# Altium schematic sheet Sheet6.SchDoc
size 420 x 297 mm; DocumentNumber: ЭАЕСН.464512.003Э3; SheetNumber: 6; SheetTotal: x; DocumentName: Sheet1.SCHDOC
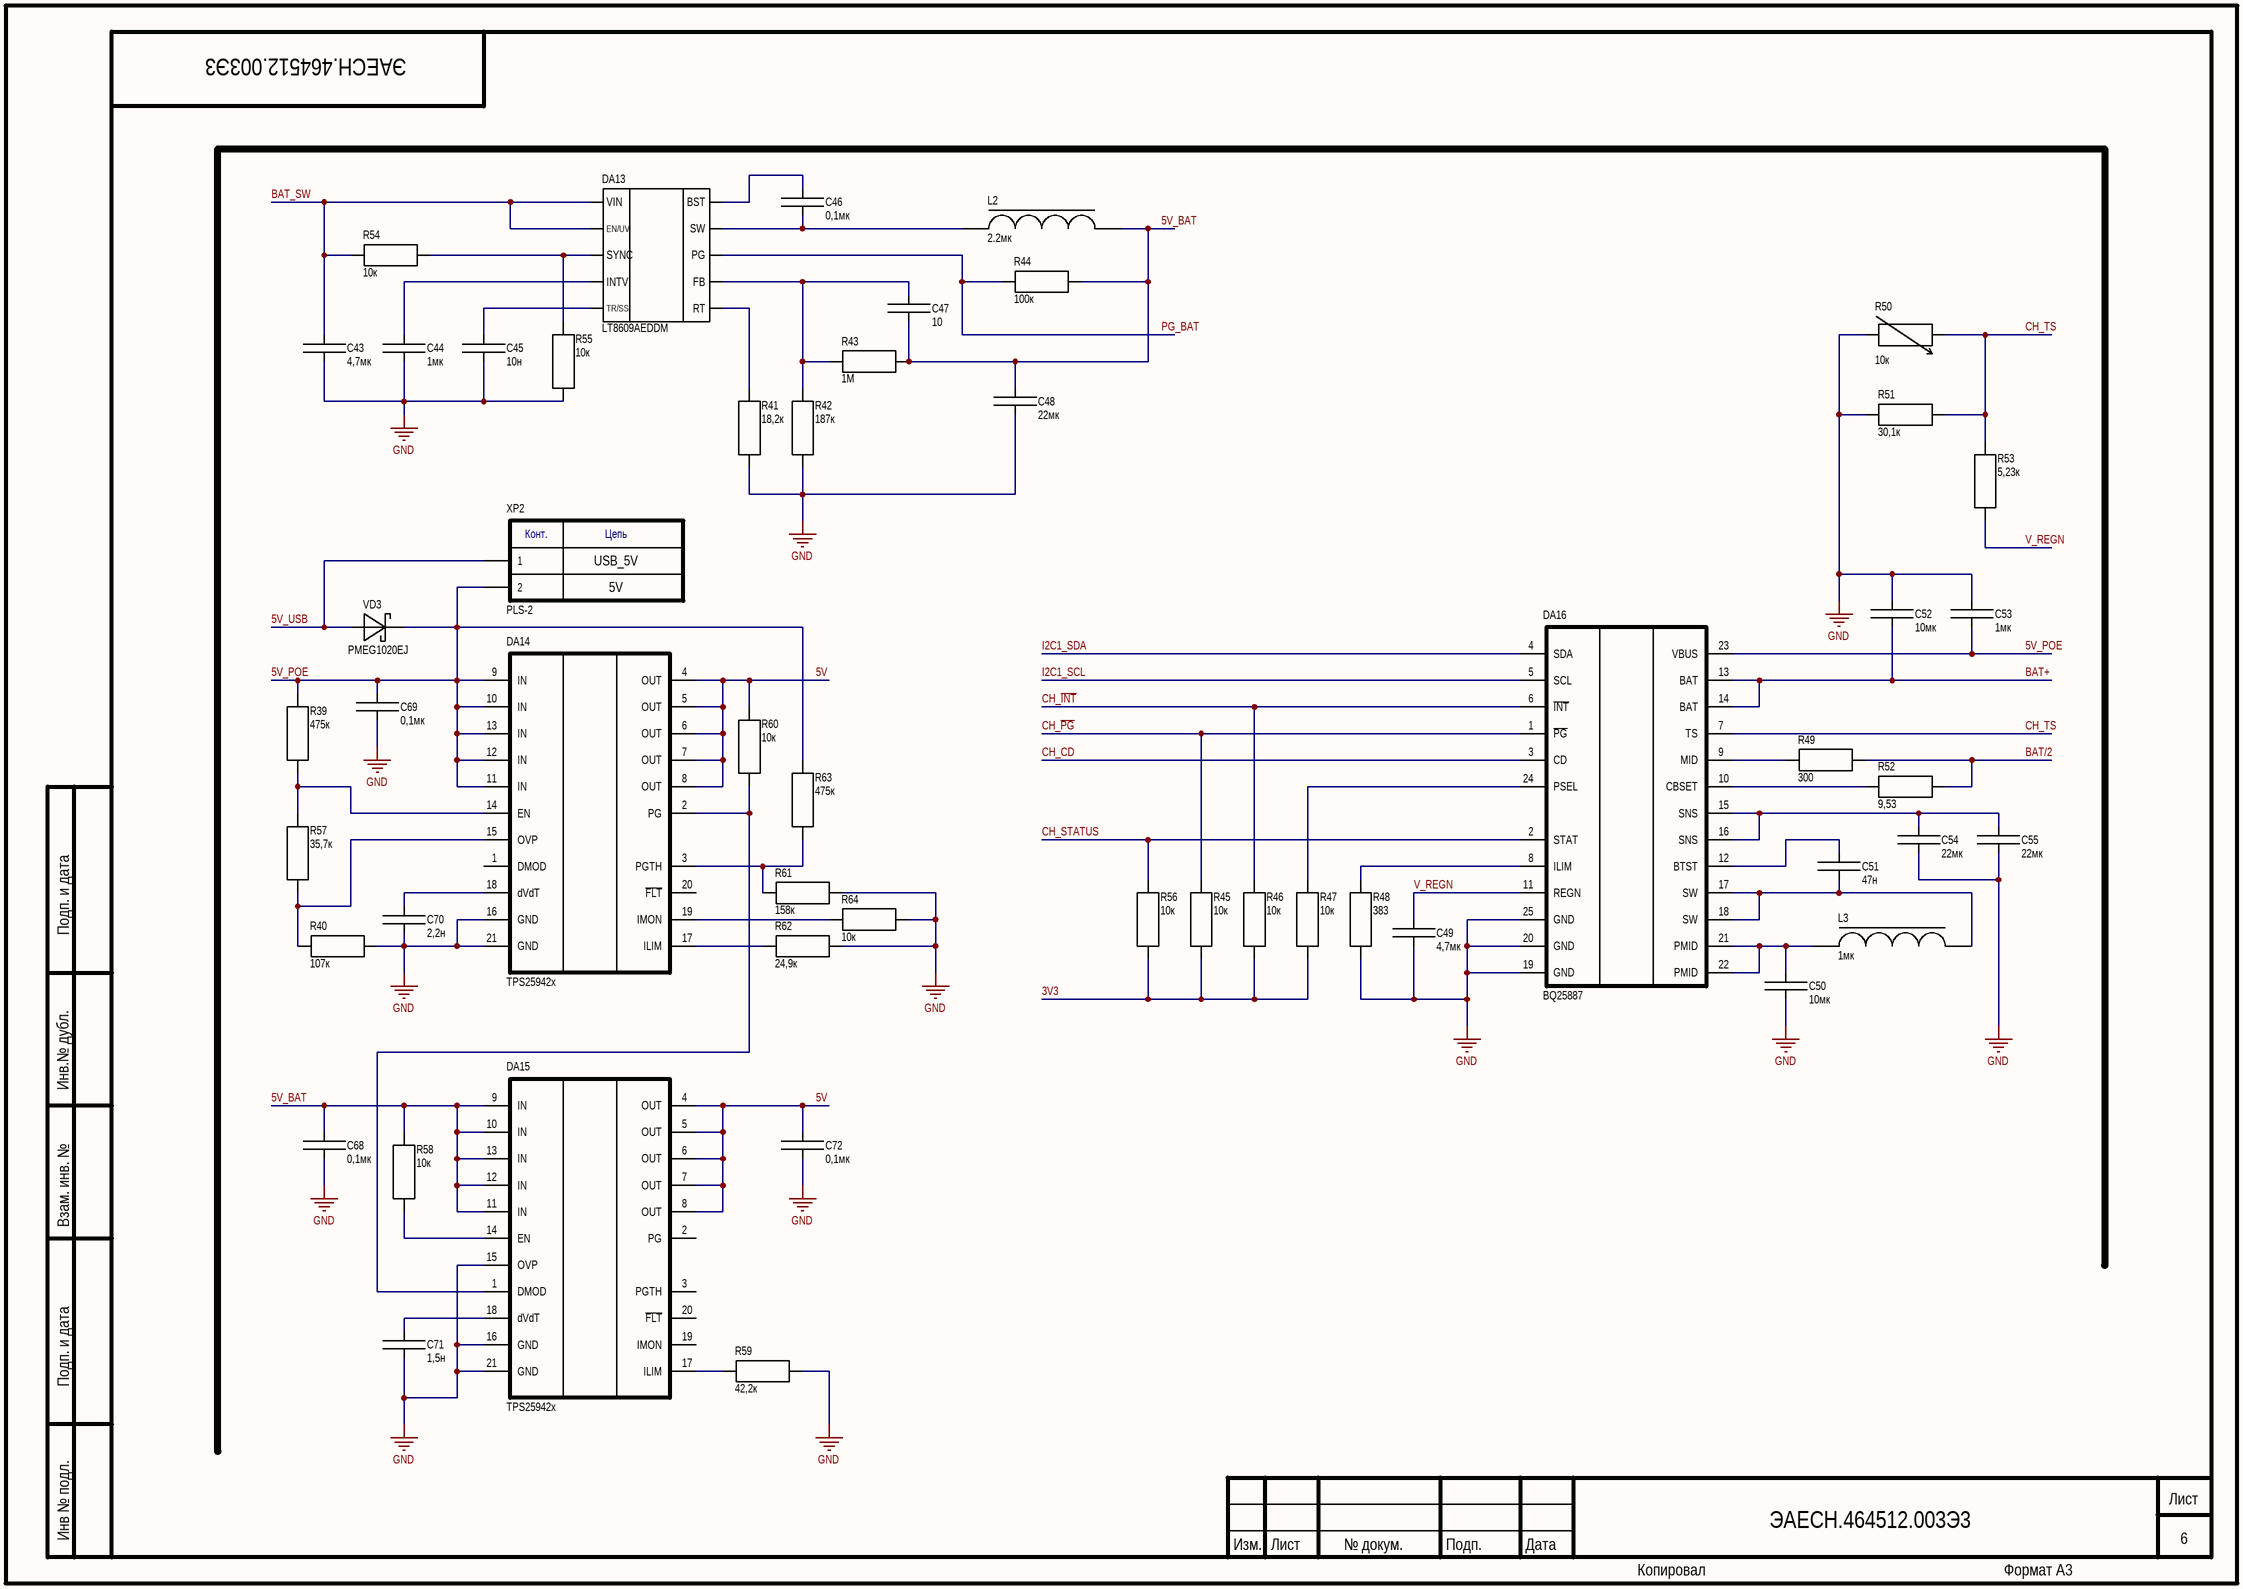
[diagram p0: Sheet6.SchDoc]

## Parts
C43  value 4,7мк  [С0603]  (hidden comment: C)
C44  value 1мк  [С0603]  (hidden comment: C)
C45  value 10н  [С0603]  (hidden comment: C)
C46  value 0,1мк  [С0603]  (hidden comment: C)
C47  value 10  [С0603]  (hidden comment: C)
C48  value 22мк  [C1206]  (hidden comment: C)
C49  value 4,7мк  [С0603]  (hidden comment: C)
C50  value 10мк  [С0603]  (hidden comment: C)
C51  value 47н  [С0603]  (hidden comment: C)
C52  value 10мк  [С0603]  (hidden comment: C)
C53  value 1мк  [С0603]  (hidden comment: C)
C54  value 22мк  [C1206]  (hidden comment: C)
C55  value 22мк  [C1206]  (hidden comment: C)
C68  value 0,1мк  [С0603]  (hidden comment: C)
C69  value 0,1мк  [С0603]  (hidden comment: C)
C70  value 2,2н  [С0603]  (hidden comment: C)
C71  value 1,5н  [С0603]  (hidden comment: C)
C72  value 0,1мк  [С0603]  (hidden comment: C)
DA13  LT8609AEDDM  [SON-10]
DA14  TPS25942x  [WQFN-20]
DA15  TPS25942x  [WQFN-20]
DA16  BQ25887  [VQFN-24]
L2  2.2мк  [IND_6.5x6.5_VISHAY]
L3  1мк  [IND_6.5x6.5_VISHAY]
R39  value 475к  [R0603]  (hidden comment: R)
R40  value 107к  [R0603]  (hidden comment: R)
R41  value 18,2к  [R0603]  (hidden comment: R)
R42  value 187к  [R0603]  (hidden comment: R)
R43  value 1М  [R0603]  (hidden comment: R)
R44  value 100к  [R0603]  (hidden comment: R)
R45  value 10к  [R0603]  (hidden comment: R)
R46  value 10к  [R0603]  (hidden comment: R)
R47  value 10к  [R0603]  (hidden comment: R)
R48  value 383  [R0603]  (hidden comment: R)
R49  value 300  [R0603]  (hidden comment: R)
R50  value 10к  [R0603]  (hidden comment: EWTF03-103H3T-N)
R51  value 30,1к  [R0603]  (hidden comment: R)
R52  value 9,53  [R0603]  (hidden comment: R)
R53  value 5,23к  [R0603]  (hidden comment: R)
R54  value 10к  [R0603]  (hidden comment: R)
R55  value 10к  [R0603]  (hidden comment: R)
R56  value 10к  [R0603]  (hidden comment: R)
R57  value 35,7к  [R0603]  (hidden comment: R)
R58  value 10к  [R0603]  (hidden comment: R)
R59  value 42,2к  [R0603]  (hidden comment: R)
R60  value 10к  [R0603]  (hidden comment: R)
R61  value 158к  [R0603]  (hidden comment: R)
R62  value 24,9к  [R0603]  (hidden comment: R)
R63  value 475к  [R0603]  (hidden comment: R)
R64  value 10к  [R0603]  (hidden comment: R)
VD3  PMEG1020EJ  [SOD323F]
XP2  PLS-2  [PLS-2]

## Nets
GND: C43.2 C44.2 C45.2 C48.2 C49.2 C50.2 C52.1 C53.1 C54.2 C55.2 C68.2 C69.2 C70.2 C71.2 C72.2 DA14.16(GND) DA14.21(GND) DA15.15(OVP) DA15.16(GND) DA15.21(GND) DA16.19(GND) DA16.20(GND) DA16.25(GND) R40.2 R41.1 R42.2 R48.1 R50.1 R51.1 R55.1 R59.2 R61.1 R62.2 R64.1
3V3: R45.2 R46.2 R47.2 R56.2
5V: C72.1 DA14.4(OUT) DA14.5(OUT) DA14.6(OUT) DA14.7(OUT) DA14.8(OUT) DA15.4(OUT) DA15.5(OUT) DA15.6(OUT) DA15.7(OUT) DA15.8(OUT) R60.2
5V_BAT: C47.1 C48.1 C68.1 DA15.9(IN) DA15.10(IN) DA15.11(IN) DA15.12(IN) DA15.13(IN) L2.1 R43.2 R44.1 R58.2
5V_POE: C53.2 C69.1 DA14.9(IN) DA14.10(IN) DA14.11(IN) DA14.12(IN) DA14.13(IN) DA16.23(VBUS) R39.2 R63.2 VD3.1(C) XP2.2
5V_USB: VD3.2(A) XP2.1
BAT+: C52.2 DA16.13(BAT) DA16.14(BAT)
BAT/2: R49.2 R52.2
BAT_SW: C43.1 DA13.9(VIN) DA13.10(EN/UV) R54.1
CH_CD: DA16.3(CD)
CH_~{INT}: DA16.6(~{INT}) R46.1
CH_~{PG}: DA16.1(~{PG}) R45.1
CH_STATUS: DA16.2(STAT) R56.1
CH_TS: DA16.7(TS) R50.2 R51.2 R53.1
I2C1_SCL: DA16.5(SCL)
I2C1_SDA: DA16.4(SDA)
PG_BAT: DA13.8(PG) R44.2
V_REGN: C49.1 DA16.11(REGN) R53.2
NetC44_1: C44.1 DA13.3(INTV)
NetC45_1: C45.1 DA13.7(TR/SS)
NetC46_1: C46.1 DA13.1(BST)
NetC46_2: C46.2 DA13.2(SW) L2.2
NetC47_2: C47.2 DA13.6(FB) R42.1 R43.1
NetC50_1: C50.1 DA16.21(PMID) DA16.22(PMID) L3.2
NetC51_1: C51.1 DA16.12(BTST)
NetC51_2: C51.2 DA16.17(SW) DA16.18(SW) L3.1
NetC54_1: C54.1 C55.1 DA16.15(SNS) DA16.16(SNS)
NetC70_1: C70.1 DA14.18(dVdT)
NetC71_1: C71.1 DA15.18(dVdT)
NetDA13_4: DA13.4(RT) R41.2
NetDA13_5: DA13.5(SYNC) R54.2 R55.2
NetDA14_2: DA14.2(PG) DA15.1(DMOD) R60.1
NetDA14_3: DA14.3(PGTH) R61.2 R63.1
NetDA14_14: DA14.14(EN) R39.1 R57.2
NetDA14_15: DA14.15(OVP) R40.1 R57.1
NetDA14_17: DA14.17(ILIM) R62.1
NetDA14_19: DA14.19(IMON) R64.2
NetDA15_14: DA15.14(EN) R58.1
NetDA15_17: DA15.17(ILIM) R59.1
NetDA16_8: DA16.8(ILIM) R48.2
NetDA16_9: DA16.9(MID) R49.1
NetDA16_10: DA16.10(CBSET) R52.1
NetDA16_24: DA16.24(PSEL) R47.1

Not connected (* = marked no-connect by the designer): DA14 1(DMOD) 20(~{FLT}); DA15 2(PG) 3(PGTH) 19(IMON) 20(~{FLT})

## Notes on the sheet
- USB_5V
- 5V
- Подп. и дата
- Инв.№ дубл.
- Взам. инв. №
- Инв № подл.
- Изм.
- Лист
- № докум.
- Подп.
- Дата
- Копировал
- Формат А3
- (in symbol 2pin) Конт.; Цепь

## Library data of the parts
L2 = L: PartNumber: IHLP2525CZER2R2MA1
L3 = L: PartNumber: IHLP2525CZER1R0M01
R50 = R_term_n
VD3 = VD_sh
XP2 = 2pin